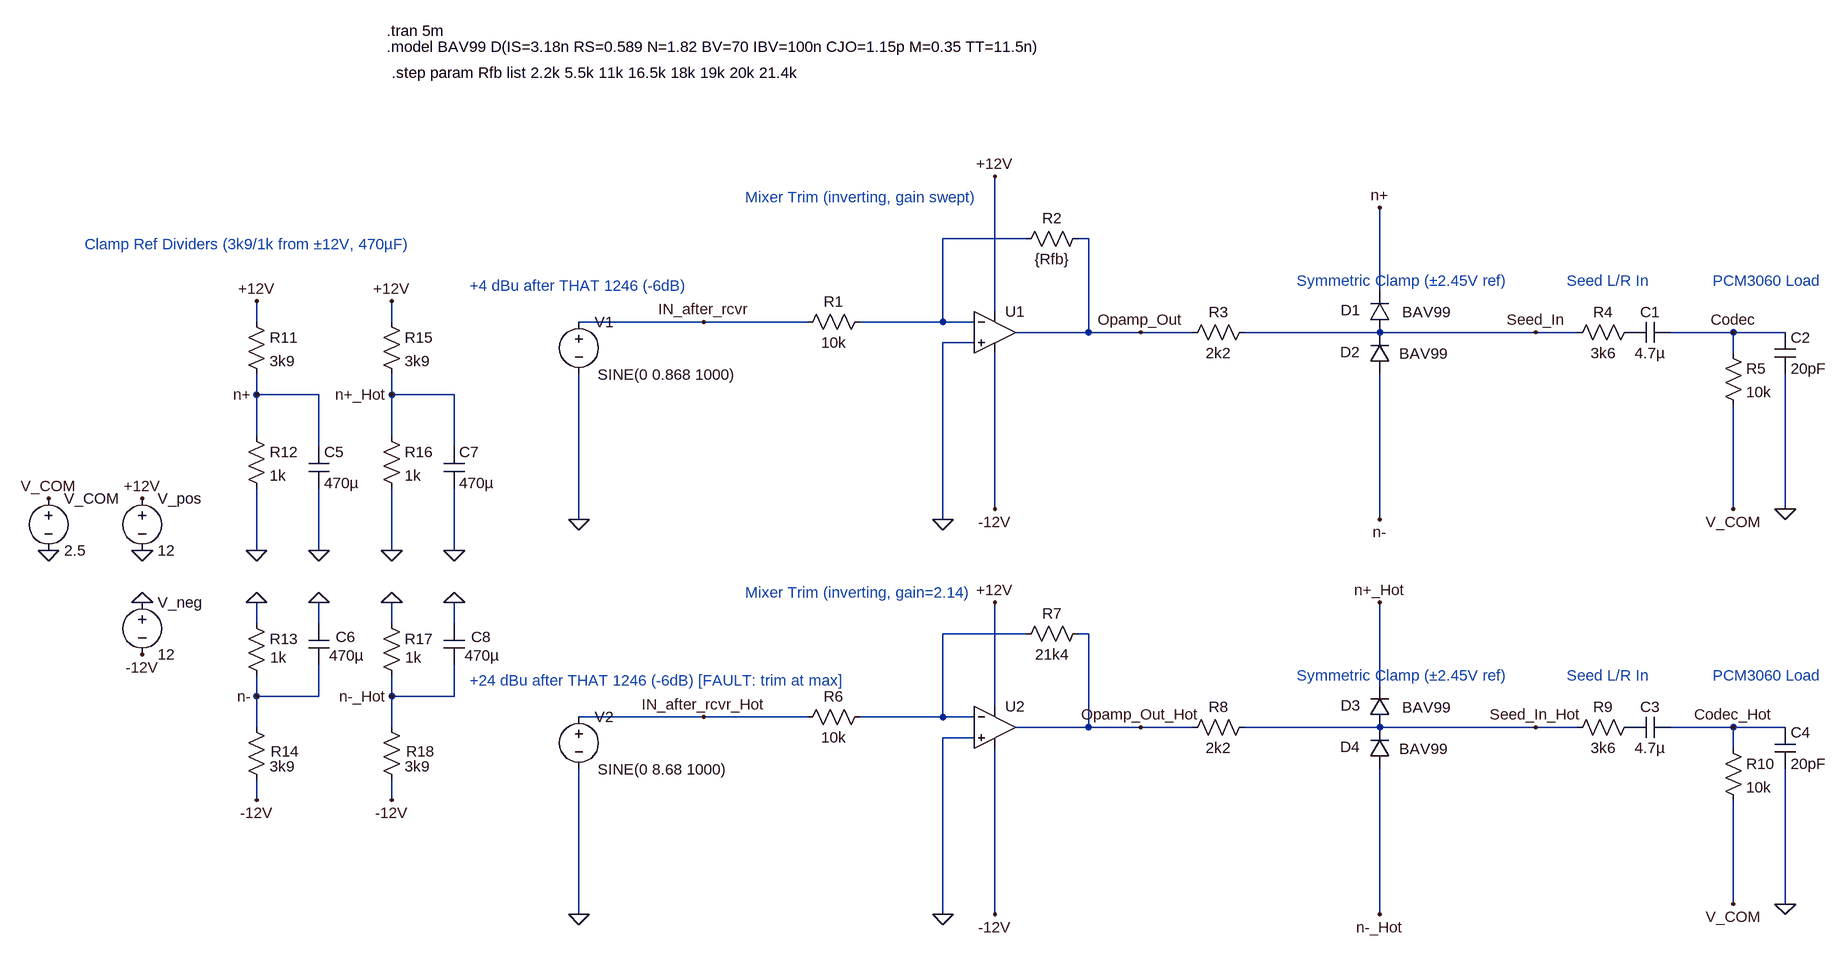
[diagram p0: schematic Input-sim.asc]
Input-sim.asc, the LTspice schematic file:
Version 4
SHEET 1 2400 1800
WIRE 416 496 288 496
WIRE 512 496 496 496
WIRE 960 576 960 448
WIRE 368 608 368 400
WIRE -768 624 -768 592
WIRE -560 624 -560 592
WIRE -80 624 -272 624
WIRE 80 624 -80 624
WIRE 288 624 288 496
WIRE 288 624 160 624
WIRE 336 624 288 624
WIRE 512 640 512 496
WIRE 512 640 400 640
WIRE 592 640 512 640
WIRE 672 640 592 640
WIRE 960 640 752 640
WIRE 1200 640 960 640
WIRE 1264 640 1200 640
WIRE 1504 640 1408 640
WIRE 1584 640 1504 640
WIRE 336 656 288 656
WIRE 1504 672 1504 640
WIRE -768 736 -768 704
WIRE -672 736 -768 736
WIRE -560 736 -560 704
WIRE -464 736 -560 736
WIRE -768 800 -768 736
WIRE -560 800 -560 736
WIRE -672 816 -672 736
WIRE -464 816 -464 736
WIRE 368 912 368 672
WIRE 1504 912 1504 752
WIRE 1584 912 1584 704
WIRE -272 928 -272 704
WIRE 288 928 288 656
WIRE 960 928 960 704
WIRE -768 976 -768 880
WIRE -672 976 -672 880
WIRE -560 976 -560 880
WIRE -464 976 -464 880
WIRE -768 1088 -768 1056
WIRE -672 1088 -672 1056
WIRE -560 1088 -560 1056
WIRE -464 1088 -464 1056
WIRE 416 1104 288 1104
WIRE 512 1104 496 1104
WIRE 960 1184 960 1056
WIRE -768 1200 -768 1168
WIRE -672 1200 -672 1152
WIRE -672 1200 -768 1200
WIRE -560 1200 -560 1168
WIRE -464 1200 -464 1152
WIRE -464 1200 -560 1200
WIRE 368 1216 368 1056
WIRE -80 1232 -272 1232
WIRE 80 1232 -80 1232
WIRE 288 1232 288 1104
WIRE 288 1232 160 1232
WIRE 336 1232 288 1232
WIRE -768 1248 -768 1200
WIRE -560 1248 -560 1200
WIRE 512 1248 512 1104
WIRE 512 1248 400 1248
WIRE 592 1248 512 1248
WIRE 672 1248 592 1248
WIRE 960 1248 752 1248
WIRE 1200 1248 960 1248
WIRE 1264 1248 1200 1248
WIRE 1504 1248 1408 1248
WIRE 1584 1248 1504 1248
WIRE 336 1264 288 1264
WIRE 1504 1280 1504 1248
WIRE -768 1360 -768 1328
WIRE -560 1360 -560 1328
WIRE 1504 1520 1504 1360
WIRE 1584 1520 1584 1312
WIRE -272 1536 -272 1312
WIRE 288 1536 288 1264
WIRE 368 1536 368 1280
WIRE 960 1536 960 1312
FLAG -944 896 +12V
FLAG -944 976 0
FLAG -944 1056 0
FLAG -944 1136 -12V
FLAG -768 592 +12V
FLAG -768 736 n+
FLAG -768 976 0
FLAG -672 976 0
FLAG -768 1056 0
FLAG -768 1200 n-
FLAG -768 1360 -12V
FLAG -672 1056 0
FLAG -1088 896 V_COM
FLAG -1088 976 0
FLAG -272 928 0
FLAG -80 624 IN_after_rcvr
FLAG 288 928 0
FLAG 368 400 +12V
FLAG 368 912 -12V
FLAG 592 640 Opamp_Out
FLAG 1200 640 Seed_In
FLAG 960 448 n+
FLAG 960 928 n-
FLAG 1504 640 Codec
FLAG 1504 912 V_COM
FLAG 1584 912 0
FLAG -272 1536 0
FLAG -80 1232 IN_after_rcvr_Hot
FLAG 288 1536 0
FLAG 368 1056 +12V
FLAG 368 1536 -12V
FLAG 592 1248 Opamp_Out_Hot
FLAG 1200 1248 Seed_In_Hot
FLAG 960 1056 n+_Hot
FLAG 960 1536 n-_Hot
FLAG 1504 1248 Codec_Hot
FLAG 1504 1520 V_COM
FLAG 1584 1520 0
FLAG -560 592 +12V
FLAG -560 736 n+_Hot
FLAG -560 976 0
FLAG -464 976 0
FLAG -560 1056 0
FLAG -560 1200 n-_Hot
FLAG -560 1360 -12V
FLAG -464 1056 0
SYMBOL voltage -944 880 R0
SYMATTR InstName V_pos
SYMATTR Value 12
SYMBOL voltage -944 1040 R0
SYMATTR InstName V_neg
SYMATTR Value 12
SYMBOL res -784 608 R0
SYMATTR InstName R11
SYMATTR Value 3k9
SYMBOL res -784 784 R0
SYMATTR InstName R12
SYMATTR Value 1k
SYMBOL cap -688 816 R0
SYMATTR InstName C5
SYMATTR Value 470µ
SYMBOL res -784 1072 R0
WINDOW 3 37 68 Left 2
SYMATTR Value 1k
SYMATTR InstName R13
SYMBOL res -784 1232 R0
WINDOW 0 38 53 Left 2
SYMATTR InstName R14
SYMATTR Value 3k9
SYMBOL cap -688 1088 R0
WINDOW 0 42 21 Left 2
WINDOW 3 32 49 Left 2
SYMATTR InstName C6
SYMATTR Value 470µ
SYMBOL voltage -1088 880 R0
SYMATTR InstName V_COM
SYMATTR Value 2.5
SYMBOL voltage -272 608 R0
WINDOW 3 29 97 Left 2
SYMATTR Value SINE(0 0.868 1000)
SYMATTR InstName V1
SYMATTR Value2 AC 1
SYMBOL res 64 640 R270
WINDOW 0 32 56 VTop 2
WINDOW 3 0 56 VBottom 2
SYMATTR InstName R1
SYMATTR Value 10k
SYMBOL OpAmps/UniversalOpAmp2 368 640 R0
SYMATTR InstName U1
SYMATTR Value2 Avol=1Meg GBW=53Meg Slew=24Meg
SYMBOL res 400 512 R270
WINDOW 0 32 56 VTop 2
WINDOW 3 0 56 VBottom 2
SYMATTR InstName R2
SYMATTR Value {Rfb}
SYMBOL res 656 656 R270
WINDOW 0 32 56 VTop 2
WINDOW 3 0 56 VBottom 2
SYMATTR InstName R3
SYMATTR Value 2k2
SYMBOL diode 976 640 R180
WINDOW 0 45 34 Left 2
WINDOW 3 -93 31 Left 2
SYMATTR InstName D1
SYMATTR Value BAV99
SYMBOL diode 976 704 R180
WINDOW 0 46 34 Left 2
WINDOW 3 -88 31 Left 2
SYMATTR InstName D2
SYMATTR Value BAV99
SYMBOL res 1248 656 R270
WINDOW 0 32 56 VTop 2
WINDOW 3 0 56 VBottom 2
SYMATTR InstName R4
SYMATTR Value 3k6
SYMBOL cap 1408 624 R90
WINDOW 0 0 32 VBottom 2
WINDOW 3 32 32 VTop 2
SYMATTR InstName C1
SYMATTR Value 4.7µ
SYMBOL res 1488 656 R0
SYMATTR InstName R5
SYMATTR Value 10k
SYMBOL cap 1568 640 R0
SYMATTR InstName C2
SYMATTR Value 20pF
SYMBOL voltage -272 1216 R0
WINDOW 3 29 97 Left 2
SYMATTR Value SINE(0 8.68 1000)
SYMATTR InstName V2
SYMATTR Value2 AC 1
SYMBOL res 64 1248 R270
WINDOW 0 32 56 VTop 2
WINDOW 3 0 56 VBottom 2
SYMATTR InstName R6
SYMATTR Value 10k
SYMBOL OpAmps/UniversalOpAmp2 368 1248 R0
SYMATTR InstName U2
SYMATTR Value2 Avol=1Meg GBW=53Meg Slew=24Meg
SYMBOL res 400 1120 R270
WINDOW 0 32 56 VTop 2
WINDOW 3 0 56 VBottom 2
SYMATTR InstName R7
SYMATTR Value 21k4
SYMBOL res 656 1264 R270
WINDOW 0 32 56 VTop 2
WINDOW 3 0 56 VBottom 2
SYMATTR InstName R8
SYMATTR Value 2k2
SYMBOL diode 976 1248 R180
WINDOW 0 45 34 Left 2
WINDOW 3 -93 31 Left 2
SYMATTR InstName D3
SYMATTR Value BAV99
SYMBOL diode 976 1312 R180
WINDOW 0 46 34 Left 2
WINDOW 3 -88 31 Left 2
SYMATTR InstName D4
SYMATTR Value BAV99
SYMBOL res 1248 1264 R270
WINDOW 0 32 56 VTop 2
WINDOW 3 0 56 VBottom 2
SYMATTR InstName R9
SYMATTR Value 3k6
SYMBOL cap 1408 1232 R90
WINDOW 0 0 32 VBottom 2
WINDOW 3 32 32 VTop 2
SYMATTR InstName C3
SYMATTR Value 4.7µ
SYMBOL res 1488 1264 R0
SYMATTR InstName R10
SYMATTR Value 10k
SYMBOL cap 1568 1248 R0
SYMATTR InstName C4
SYMATTR Value 20pF
SYMBOL res -576 608 R0
SYMATTR InstName R15
SYMATTR Value 3k9
SYMBOL res -576 784 R0
SYMATTR InstName R16
SYMATTR Value 1k
SYMBOL cap -480 816 R0
SYMATTR InstName C7
SYMATTR Value 470µ
SYMBOL res -576 1072 R0
WINDOW 3 37 68 Left 2
SYMATTR Value 1k
SYMATTR InstName R17
SYMBOL res -576 1232 R0
WINDOW 0 38 53 Left 2
SYMATTR InstName R18
SYMATTR Value 3k9
SYMBOL cap -480 1088 R0
WINDOW 0 42 21 Left 2
WINDOW 3 32 49 Left 2
SYMATTR InstName C8
SYMATTR Value 470µ
TEXT -568 176 Left 2 !.tran 5m
TEXT -560 240 Left 2 !.step param Rfb list 2.2k 5.5k 11k 16.5k 18k 19k 20k 21.4k
TEXT -568 200 Left 2 !.model BAV99 D(IS=3.18n RS=0.589 N=1.82 BV=70 IBV=100n CJO=1.15p M=0.35 TT=11.5n)
TEXT -440 568 Left 2 ;+4 dBu after THAT 1246 (-6dB)
TEXT -16 432 Left 2 ;Mixer Trim (inverting, gain swept)
TEXT 832 560 Left 2 ;Symmetric Clamp (±2.45V ref)
TEXT 1248 560 Left 2 ;Seed L/R In
TEXT 1472 560 Left 2 ;PCM3060 Load
TEXT -440 1176 Left 2 ;+24 dBu after THAT 1246 (-6dB) [FAULT: trim at max]
TEXT -16 1040 Left 2 ;Mixer Trim (inverting, gain=2.14)
TEXT 832 1168 Left 2 ;Symmetric Clamp (±2.45V ref)
TEXT 1248 1168 Left 2 ;Seed L/R In
TEXT 1472 1168 Left 2 ;PCM3060 Load
TEXT -1032 504 Left 2 ;Clamp Ref Dividers (3k9/1k from ±12V, 470µF)

The netlist it stands for:
* Input-sim.asc
V_pos +12V 0 12
V_neg 0 -12V 12
R11 +12V n+ 3k9
R12 n+ 0 1k
C5 n+ 0 470µ
R13 0 n- 1k
R14 n- -12V 3k9
C6 0 n- 470µ
V_COM V_COM 0 2.5
V1 IN_after_rcvr 0 SINE(0 0.868 1000) AC 1
R1 IN_after_rcvr N001 10k
XU1 0 N001 +12V -12V Opamp_Out level2 Avol=1Meg GBW=53Meg Slew=24Meg Ilimit=25m Rail=0 Vos=0 En=0 Enk=0 In=0 Ink=0 Rin=500Meg  ; pins In+ In- V+ V- OUT
R2 N001 Opamp_Out {Rfb}
R3 Opamp_Out Seed_In 2k2
D1 Seed_In n+ BAV99
D2 n- Seed_In BAV99
R4 Seed_In P001 3k6
C1 Codec P001 4.7µ
R5 Codec V_COM 10k
C2 Codec 0 20pF
V2 IN_after_rcvr_Hot 0 SINE(0 8.68 1000) AC 1
R6 IN_after_rcvr_Hot N002 10k
XU2 0 N002 +12V -12V Opamp_Out_Hot level2 Avol=1Meg GBW=53Meg Slew=24Meg Ilimit=25m Rail=0 Vos=0 En=0 Enk=0 In=0 Ink=0 Rin=500Meg  ; pins In+ In- V+ V- OUT
R7 N002 Opamp_Out_Hot 21k4
R8 Opamp_Out_Hot Seed_In_Hot 2k2
D3 Seed_In_Hot n+_Hot BAV99
D4 n-_Hot Seed_In_Hot BAV99
R9 Seed_In_Hot P002 3k6
C3 Codec_Hot P002 4.7µ
R10 Codec_Hot V_COM 10k
C4 Codec_Hot 0 20pF
R15 +12V n+_Hot 3k9
R16 n+_Hot 0 1k
C7 n+_Hot 0 470µ
R17 0 n-_Hot 1k
R18 n-_Hot -12V 3k9
C8 0 n-_Hot 470µ
.model D D
.lib standard.dio
.tran 5m
.step param Rfb list 2.2k 5.5k 11k 16.5k 18k 19k 20k 21.4k
.model BAV99 D(IS=3.18n RS=0.589 N=1.82 BV=70 IBV=100n CJO=1.15p M=0.35 TT=11.5n)
* +4 dBu after THAT 1246 (-6dB)
* Mixer Trim (inverting, gain swept)
* Symmetric Clamp (±2.45V ref)
* Seed L/R In
* PCM3060 Load
* +24 dBu after THAT 1246 (-6dB) [FAULT: trim at max]
* Mixer Trim (inverting, gain=2.14)
* Symmetric Clamp (±2.45V ref)
* Seed L/R In
* PCM3060 Load
* Clamp Ref Dividers (3k9/1k from ±12V, 470µF)
.lib UniversalOpAmp2.lib
.backanno
.end